# Altium schematic sheet lv-supply.SchDoc
size A; SheetNumber: 6; SheetTotal: 9
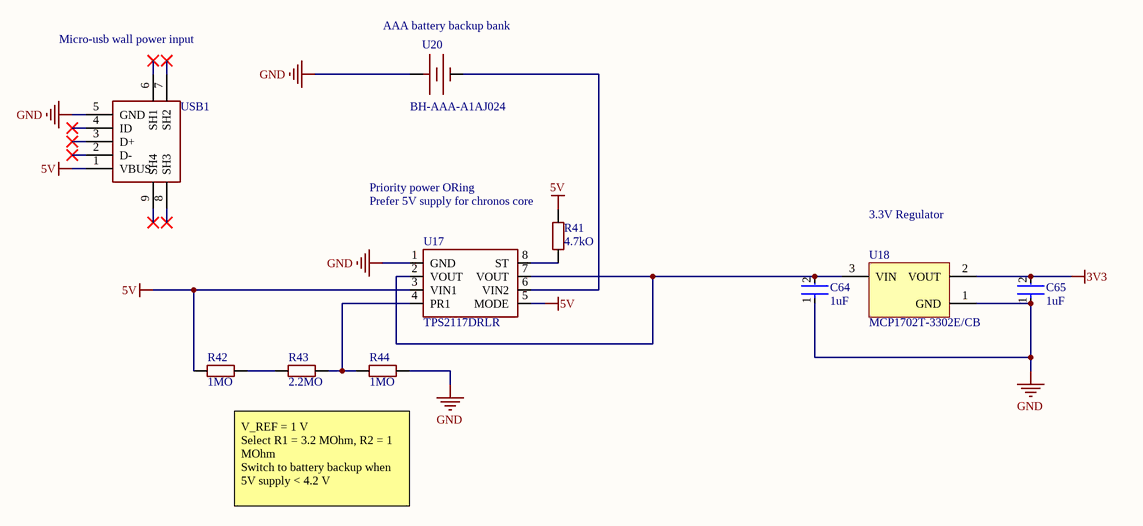
[diagram p0: lv-supply.SchDoc]

## Parts
C64  Capacitance: 1uF  [FP-CL542-IPC_C]  (hidden comment: CL05A105KA5NQNC)
C65  Capacitance: 1uF  [FP-CL542-IPC_C]  (hidden comment: CL05A105KA5NQNC)
R41  value 4.7kO  [0402WGF4701TCE]  (hidden comment: 0402WGF4701TCE)
R42  value 1MO  [0402WGF1004TCE]  (hidden comment: 0402WGF1004TCE)
R43  value 2.2MO  [0603WAF2204T5E]  (hidden comment: 0603WAF2204T5E)
R44  value 1MO  [0402WGF1004TCE]  (hidden comment: 0402WGF1004TCE)
U17  TPS2117DRLR  [TPS2117DRLR]
U18  MCP1702T-3302E/CB  [SOT-23A-CB3_N]
U20  BH-AAA-A1AJ024  [BH-AAA-A1AJ024]
USB1  MicroXNJ  [MicroXNJ]  (value not drawn)

## Nets
3V3: C65.2 U18.2(VOUT)
5V: R41.2 R42.2 U17.3(VIN1) U17.5(MODE) USB1.1(VBUS)
GND: C64.1 C65.1 R44.1 U17.1(GND) U18.1(GND) U20.2(+) USB1.5(GND)
NetC64_2: C64.2 U17.2(VOUT) U17.7(VOUT) U18.3(VIN)
NetR41_1: R41.1 U17.8(ST)
NetR42_1: R42.1 R43.2
NetR43_1: R43.1 R44.2 U17.4(PR1)
NetU17_6: U17.6(VIN2) U20.1(-)

Not connected (* = marked no-connect by the designer): USB1 2(D-)* 3(D+)* 4(ID)* 6(SH1)* 7(SH2)* 8(SH3)* 9(SH4)*

## Notes on the sheet
- Micro-usb wall power input
- (near U20) AAA battery backup bank
- Priority power ORing
- (near R41) Prefer 5V supply for chronos core
- 3.3V Regulator
- V_REF = 1 V
  Select R1 = 3.2 MOhm, R2 = 1 MOhm
  Switch to battery backup when 5V supply < 4.2 V

## Library data of the parts
C64 C65 = CMP-13271-001051-1: Cap Ceramic 1uF 25V X5R ±10% SMD 0402 +85°C Paper T/R; Radiation Hardening: No; Lead Free: Lead Free; Package Quantity: 10000; Max Operating Temperature: 85°C; Voltage Rating: 25V; Case/Package: 0402; Min Operating Temperature: -55°C; Packaging: Tape and Reel; Tolerance: 10%; Height: 0.5mm; Thickness: 0.022inch; Case Code (Metric): 1005; Width: 0.02inch; Case Code (Imperial): 0402; Dielectric: X5R; Length: 1mm; Mount: Surface Mount; Material: Ceramic; Depth: 0.5mm
R41 = 0402WGF4701TCE: Resistors. -55C~+155C 4.7kohm 50V 62.5mW Thick Film Resistor +/-1% +/-100ppm/C 0402 Chip Resistor - Surface Mount ROHS; Manufacturer: UNI-ROYAL(Uniroyal Elec); Component Type: Resistors; Design Item ID: 0402WGF4701TCE; JLCPCB Part #: C25900; Manufacturer Part Number: 0402WGF4701TCE
R42 R44 = 0402WGF1004TCE: Resistors. -55C~+155C 1Mohm 50V 62.5mW Thick Film Resistor +/-1% +/-100ppm/C 0402 Chip Resistor - Surface Mount ROHS; Manufacturer: UNI-ROYAL(Uniroyal Elec); Component Type: Resistors; Design Item ID: 0402WGF1004TCE; JLCPCB Part #: C26083; Manufacturer Part Number: 0402WGF1004TCE
R43 = 0603WAF2204T5E: Resistors. -55C~+155C 100mW 2.2Mohm 75V Thick Film Resistor +/-1% +/-100ppm/C 0603 Chip Resistor - Surface Mount ROHS; Manufacturer: UNI-ROYAL(Uniroyal Elec); Component Type: Resistors; Design Item ID: 0603WAF2204T5E; JLCPCB Part #: C22938; Manufacturer Part Number: 0603WAF2204T5E
U17 = TPS2117DRLR: Analog Switches / Multiplexers. -40C~+105C 1.6V~5.5V 2 20mohm 2:1 Fault protection SOT-5X3 Analog Switches, Multiplexers ROHS; Manufacturer: Texas Instruments; Component Type: Integrated Circuits; Design Item ID: TPS2117DRLR; Value: *; JLCPCB Part #: C22399676; Manufacturer Part Number: TPS2117DRLR
U18 = CMP-0136-00799-1: 250 mA Low Quiescent Current LDO Regulator, 3-Pin SOT-23A, Extended Temperature, Tape and Reel; DatasheetVersion: revD, Jun-2009; PackageVersion: revBB, Aug-2009; PackageReference: SOT-23A-CB3; PackageDescription: 3-Lead Plastic Small Outline Transistor (CB) [SOT-23A]
U20 = BH-AAA-A1AJ024: Battery Connectors. -10~100C Battery holder Nickel plated No. 7 - ROHS; Manufacturer: MYOUNG; Component Type: Integrated Circuits; Design Item ID: BH-AAA-A1AJ024; Value: *; JLCPCB Part #: C5290193; Manufacturer Part Number: BH-AAA-A1AJ024
USB1 = MicroXNJ: USB Connectors. -20C~+85C 1 1.8A 30V 5,000 times 5P Black Female Micro-B Surface Mount, Right Angle USB 2.0 SMD USB Connectors ROHS; Manufacturer: SHOU HAN; Component Type: Connectors; Design Item ID: MicroXNJ; Value: *; JLCPCB Part #: C404969; Manufacturer Part Number: MicroXNJ